# EAGLE schematic IceLogicBus (EAGLE 7.5.0)
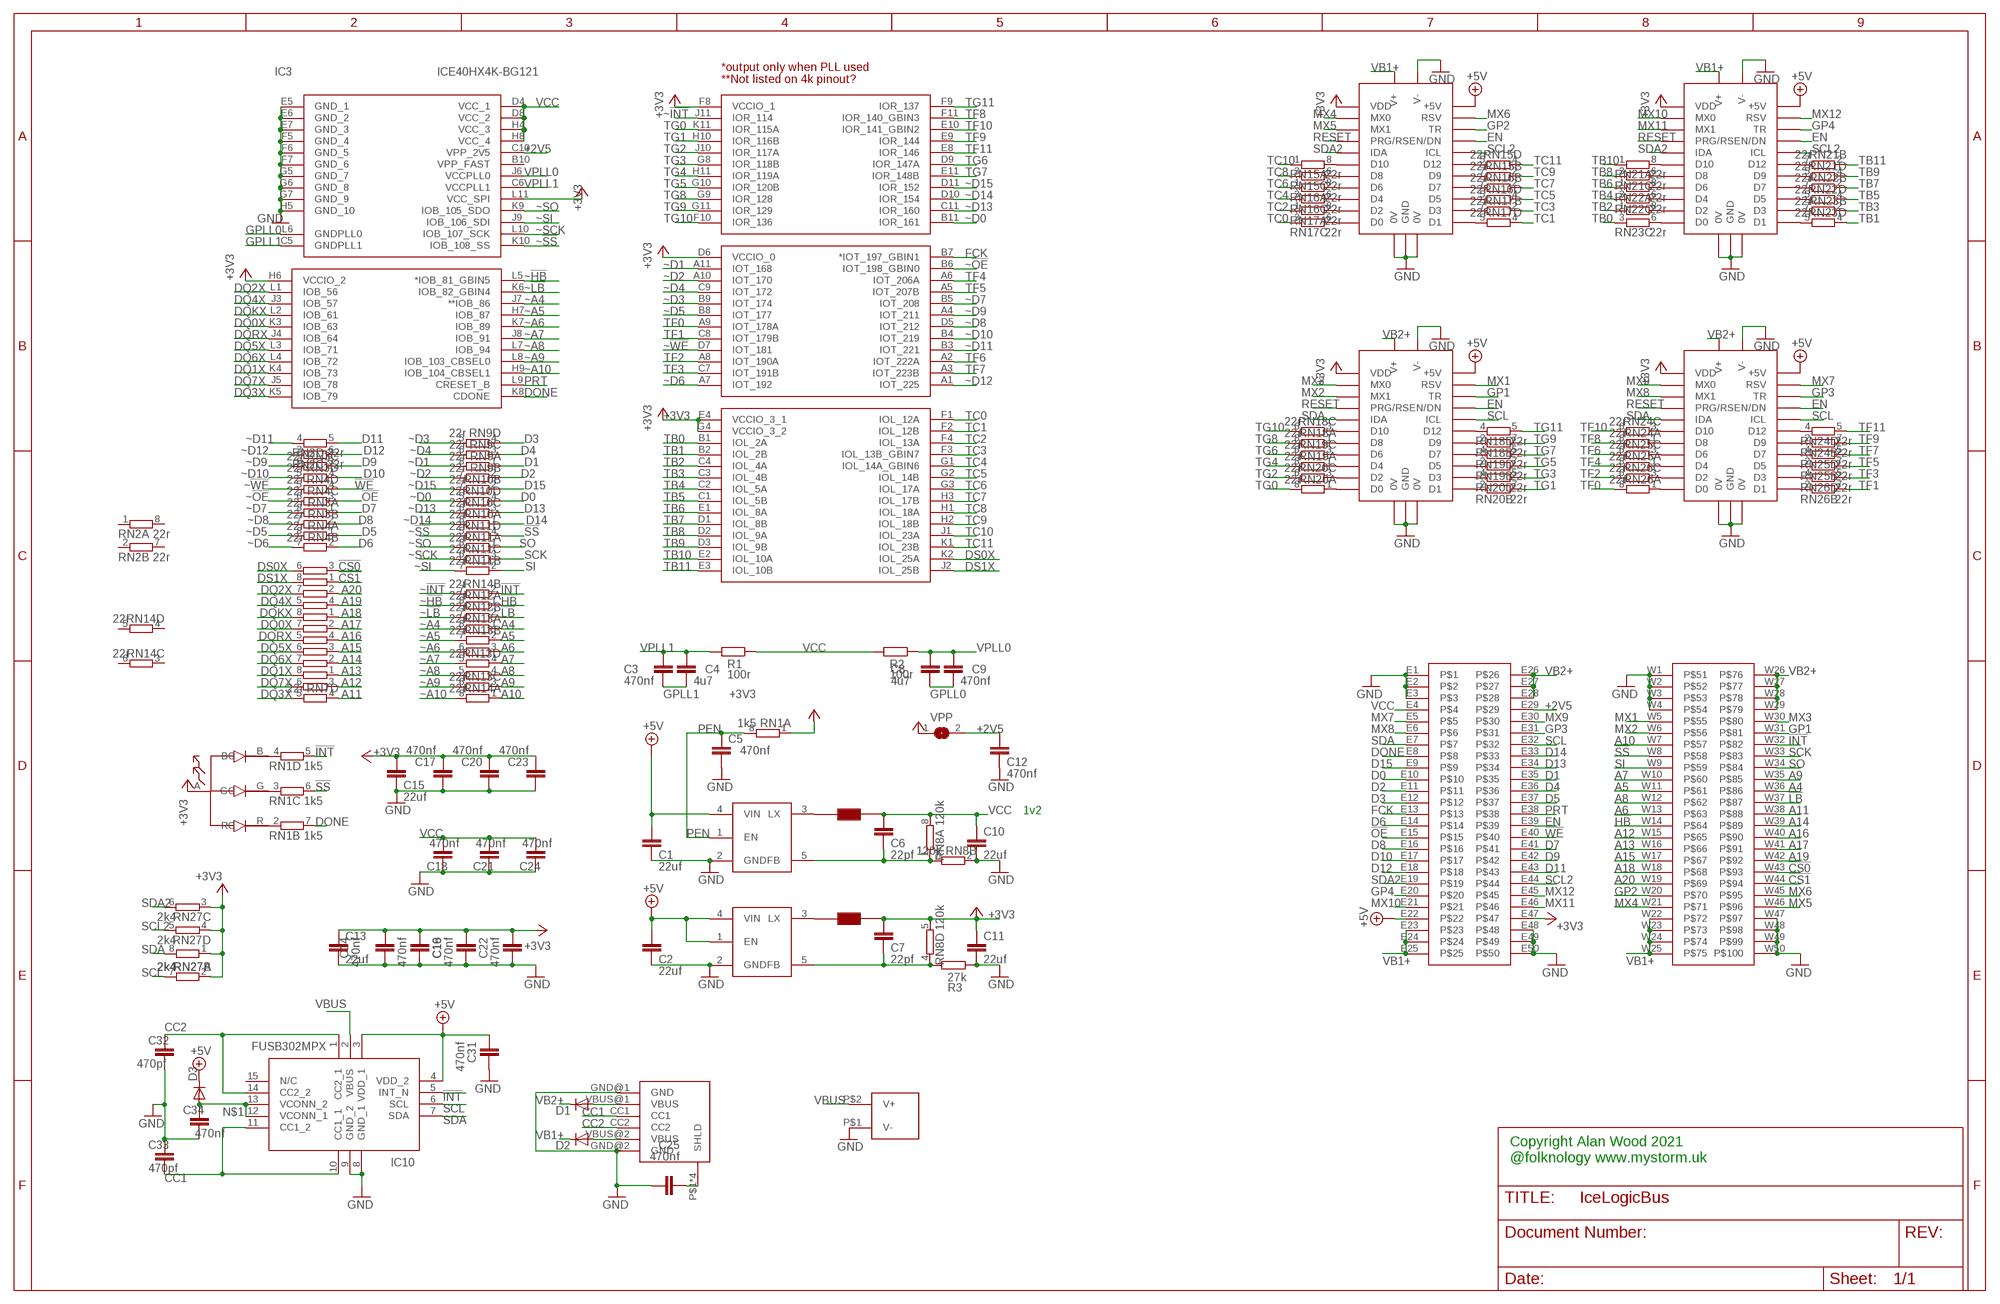
[diagram p0: schematic, sheet 1]

## Parts
C1  22uf  C-EUC0603  [C0603]
C2  22uf  C-EUC0603  [C0603]
C3  470nf  C-EUC0402  [C0402]
C4  4u7  C-EUC0402  [C0402]
C5  470nf  C-EUC0402  [C0402]
C6  22pf  C-EUC0402  [C0402]
C7  22pf  C-EUC0402  [C0402]
C8  4u7  C-EUC0402  [C0402]
C9  470nf  C-EUC0402  [C0402]
C10  22uf  C-EUC0603  [C0603]
C11  22uf  C-EUC0603  [C0603]
C12  470nf  C-EUC0402  [C0402]
C13  22uf  C-EUC0603  [C0603]
C14  470nf  C-EUC0402  [C0402]
C15  22uf  C-EUC0603  [C0603]
C16  470nf  C-EUC0402  [C0402]
C17  470nf  C-EUC0402  [C0402]
C18  470nf  C-EUC0402  [C0402]
C19  470nf  C-EUC0402  [C0402]
C20  470nf  C-EUC0402  [C0402]
C21  470nf  C-EUC0402  [C0402]
C22  470nf  C-EUC0402  [C0402]
C23  470nf  C-EUC0402  [C0402]
C24  470nf  C-EUC0402  [C0402]
C25  470nf  C-EUC0402  [C0402]
C31  470nf  C-EUC0402  [C0402]
C32  470pf  C-EUC0402  [C0402]
C33  470pf  C-EUC0402  [C0402]
C34  470nf  C-EUC0402  [C0402]
D1  DIODE-SOD123  [SOD123]
D2  DIODE-SOD123  [SOD123]
D3  DIODE-SOD323-W  [SOD323-W]
IC1  AP3429/A  [TSOP-5/SOT23-5]
IC2  AP3429/A  [TSOP-5/SOT23-5]
IC3  ICE40HX4K-BG121  [BGA121C80P11X11_900X900X110]
IC10  FUSB302MPX  [QFN50P250X250X80-15N]
L1  NRS4018  [NRC4018]
L2  NRS4018  [NRC4018]
L3  RGB_LED  [RGB_LED_IMM]
R1  100r  R-EU_R0402  [R0402]
R2  100r  R-EU_R0402  [R0402]
R3  27k  R-EU_R0402  [R0402]
RN1  1k5  4R-NEXB38V  [EXB38V]
RN2  22r  4R-NEXB38V  [EXB38V]
RN3  22r  4R-NEXB38V  [EXB38V]
RN4  22r  4R-NEXB38V  [EXB38V]
RN5  22r  4R-NEXB38V  [EXB38V]
RN6  22r  4R-NEXB38V  [EXB38V]
RN7  22r  4R-NEXB38V  [EXB38V]
RN8  120k  4R-NEXB38V  [EXB38V]
RN9  22r  4R-NEXB38V  [EXB38V]
RN10  22r  4R-NEXB38V  [EXB38V]
RN11  22r  4R-NEXB38V  [EXB38V]
RN12  22r  4R-NEXB38V  [EXB38V]
RN13  22r  4R-NEXB38V  [EXB38V]
RN14  22r  4R-NEXB38V  [EXB38V]
RN15  22r  4R-NEXB38V  [EXB38V]
RN16  22r  4R-NEXB38V  [EXB38V]
RN17  22r  4R-NEXB38V  [EXB38V]
RN18  22r  4R-NEXB38V  [EXB38V]
RN19  22r  4R-NEXB38V  [EXB38V]
RN20  22r  4R-NEXB38V  [EXB38V]
RN21  22r  4R-NEXB38V  [EXB38V]
RN22  22r  4R-NEXB38V  [EXB38V]
RN23  22r  4R-NEXB38V  [EXB38V]
RN24  22r  4R-NEXB38V  [EXB38V]
RN25  22r  4R-NEXB38V  [EXB38V]
RN26  22r  4R-NEXB38V  [EXB38V]
RN27  2k4  4R-NEXB38V  [EXB38V]
T1  UTILE_LPCARRIER_SMD_MALE_1.27  [UTILE_LP]
T2  UTILE_LPCARRIER_SMD_MALE_1.27  [UTILE_LP]
T3  MEZZANINE  [MEZZANINE]
T4  UTILE_LPCARRIER_SMD_MALE_1.27  [UTILE_LP]
T5  UTILE_LPCARRIER_SMD_MALE_1.27  [UTILE_LP]
U$1  USB-C-6  [USB-C-6]
U$2  XT-XXXT  [XT30PW-M]
VPP  SJ  [SJ]

## Nets
!CS0: RN5.3 T3.W43
!CS1: RN5.1 T3.W44
!HB: RN12.1 T3.W14
!INT: IC10.5(INT_N) RN1.5 RN14.2 T3.W32
!LB: RN12.2 T3.W37
!OE: RN4.3 T3.E15
!SS: RN1.6 RN11.4 T3.W8
!WE: RN4.4 T3.E40
+2V5: C12.2 IC3.C10(VPP_2V5) T3.E29 VPP.2
+3V3: C7.2 C11.1 C13.1 C14.2 C15.2 C16.2 C17.1 C19.2 C20.1 C22.2 C23.1 IC3.D6(VCCIO_0) IC3.E4(VCCIO_3_1) IC3.F8(VCCIO_1) IC3.G4(VCCIO_3_2) IC3.H6(VCCIO_2) IC3.L11(VCC_SPI) L2.P$2 L3.A(ANODE) RN1.1 RN8.5 RN27.1 RN27.2 RN27.3 RN27.4 T1.P$18(VDD) T2.P$18(VDD) T3.E47 T4.P$18(VDD) T5.P$18(VDD) VPP.1
+5V: C1.2 C2.2 C31.2 D3.C IC1.4(VIN) IC2.1(EN) IC2.4(VIN) IC10.3(VDD_1) IC10.4(VDD_2) T1.P$43(+5V) T2.P$43(+5V) T3.E22 T4.P$43(+5V) T5.P$43(+5V)
A4: RN13.1 T3.W36
A5: RN13.2 T3.W11
A6: RN12.3 T3.W13
A7: RN13.4 T3.W10
A8: RN12.4 T3.W12
A9: RN13.3 T3.W35
A10: RN14.1 T3.W7
A11: RN7.4 T3.W38
A12: RN7.3 T3.W15
A13: RN7.1 T3.W16
A14: RN7.2 T3.W39
A15: RN6.3 T3.W17
A16: RN6.4 T3.W40
A17: RN6.2 T3.W41
A18: RN6.1 T3.W18
A19: RN5.4 T3.W42
A20: RN5.2 T3.W19
CC1: C33.1 IC10.10(CC1_1) IC10.11(CC1_2) U$1.CC1
CC2: C32.2 IC10.1(CC2_1) IC10.14(CC2_2) U$1.CC2
D0: RN10.4 T3.E10
D1: RN9.1 T3.E35
D2: RN9.2 T3.E11
D3: RN9.4 T3.E12
D4: RN9.3 T3.E36
D5: RN4.1 T3.E37
D6: RN4.2 T3.E14
D7: RN3.1 T3.E41
D8: RN3.2 T3.E16
D9: RN3.3 T3.E42
D10: RN3.4 T3.E17
D11: RN2.5 T3.E43
D12: RN2.6 T3.E18
D13: RN10.3 T3.E34
D14: RN10.1 T3.E33
D15: RN10.2 T3.E9
DONE: IC3.K8(CDONE) RN1.7 T3.E8
DQ0X: IC3.K3(IOB_63) RN6.7
DQ1X: IC3.K4(IOB_73) RN7.8
DQ2X: IC3.L1(IOB_56) RN5.7
DQ3X: IC3.K5(IOB_79) RN7.5
DQ4X: IC3.J3(IOB_57) RN5.5
DQ5X: IC3.L3(IOB_71) RN6.6
DQ6X: IC3.L4(IOB_72) RN7.7
DQ7X: IC3.J5(IOB_78) RN7.6
DQKX: IC3.L2(IOB_61) RN6.8
DQRX: IC3.J4(IOB_64) RN6.5
DS0X: IC3.K2(IOL_25A) RN5.6
DS1X: IC3.J2(IOL_25B) RN5.8
EN: T1.P$40(EN/DN) T2.P$40(EN/DN) T3.E39 T4.P$40(EN/DN) T5.P$40(EN/DN)
FCK: IC3.B7(*IOT_197_GBIN1) T3.E13
GND: C1.1 C2.1 C5.2 C10.2 C11.2 C12.1 C13.2 C14.1 C15.1 C16.1 C17.2 C18.1 C19.1 C20.2 C21.1 C22.1 C23.2 C24.1 C25.1 C31.1 C32.1 C33.2 C34.1 IC1.2(GND) IC2.2(GND) IC3.E5(GND_1) IC3.E6(GND_2) IC3.E7(GND_3) IC3.F5(GND_4) IC3.F6(GND_5) IC3.F7(GND_6) IC3.G5(GND_7) IC3.G6(GND_8) IC3.G7(GND_9) IC3.H5(GND_10) IC10.8(GND_1) IC10.9(GND_2) R3.2 RN8.2 T1.0V@1(0V) T1.0V@2(0V) T1.P$1(V-) T1.P$2(V-) T1.P$3(V-) T1.P$4(V-) T1.P$5(V-) T1.P$6(V-) T1.P$7(GND) T1.P$26(V-) T1.P$27(V-) T1.P$28(V-) T1.P$29(V-) T1.P$30(V-) T1.P$31(V-) T1.P$32(GND) T2.0V@1(0V) T2.0V@2(0V) T2.P$1(V-) T2.P$2(V-) T2.P$3(V-) T2.P$4(V-) T2.P$5(V-) T2.P$6(V-) T2.P$7(GND) T2.P$26(V-) T2.P$27(V-) T2.P$28(V-) T2.P$29(V-) T2.P$30(V-) T2.P$31(V-) T2.P$32(GND) T3.E1 T3.E2 T3.E3 T3.E48 T3.E49 T3.E50 T3.W1 T3.W2 T3.W3 T3.W4 T3.W47 T3.W48 T3.W49 T3.W50 T4.0V@1(0V) T4.0V@2(0V) T4.P$1(V-) T4.P$2(V-) T4.P$3(V-) T4.P$4(V-) T4.P$5(V-) T4.P$6(V-) T4.P$7(GND) T4.P$26(V-) T4.P$27(V-) T4.P$28(V-) T4.P$29(V-) T4.P$30(V-) T4.P$31(V-) T4.P$32(GND) T5.0V@1(0V) T5.0V@2(0V) T5.P$1(V-) T5.P$2(V-) T5.P$3(V-) T5.P$4(V-) T5.P$5(V-) T5.P$6(V-) T5.P$7(GND) T5.P$26(V-) T5.P$27(V-) T5.P$28(V-) T5.P$29(V-) T5.P$30(V-) T5.P$31(V-) T5.P$32(GND) U$1.GND@1(GND) U$1.GND@2(GND) U$2.P$1(V-)
GP1: T2.P$41(TR) T3.W31
GP2: T1.P$41(TR) T3.W20
GP3: T3.E31 T5.P$41(TR)
GP4: T3.E20 T4.P$41(TR)
GPLL0: C8.1 C9.1 IC3.L6(GNDPLL0)
GPLL1: C3.1 C4.1 IC3.C5(GNDPLL1)
MX1: T2.P$42(RSV) T3.W5
MX2: T2.P$16(MX1) T3.W6
MX3: T2.P$17(MX0) T3.W30
MX4: T1.P$17(MX0) T3.W21
MX5: T1.P$16(MX1) T3.W46
MX6: T1.P$42(RSV) T3.W45
MX7: T3.E5 T5.P$42(RSV)
MX8: T3.E6 T5.P$16(MX1)
MX9: T3.E30 T5.P$17(MX0)
MX10: T3.E21 T4.P$17(MX0)
MX11: T3.E46 T4.P$16(MX1)
MX12: T3.E45 T4.P$42(RSV)
N$1: C34.2 D3.A IC10.12(VCONN_1) IC10.13(VCONN_2)
N$2: L3.G(GC) RN1.3
N$3: C25.2 U$1.P$1(SHLD) U$1.P$2(SHLD) U$1.P$3(SHLD) U$1.P$4(SHLD)
N$4: L3.R(RC) RN1.2
N$6: L3.B(BC) RN1.4
N$8: RN23.6 T4.P$8(D0)
N$9: RN23.5 T4.P$33(D1)
N$15: RN23.8 T4.P$9(D2)
N$16: RN23.7 T4.P$34(D3)
N$17: RN22.6 T4.P$10(D4)
N$18: C7.1 IC2.5(FB) R3.1 RN8.4
N$19: IC2.3(LX) L2.P$1
N$20: RN22.5 T4.P$35(D5)
N$21: RN22.8 T4.P$11(D6)
N$22: RN22.7 T4.P$36(D7)
N$23: RN21.6 T4.P$12(D8)
N$24: RN21.5 T4.P$37(D9)
N$25: RN21.8 T4.P$13(D10)
N$26: RN21.7 T4.P$38(D12)
N$27: RN17.8 T1.P$9(D2)
N$28: RN17.6 T1.P$8(D0)
N$29: RN17.7 T1.P$34(D3)
N$30: RN17.5 T1.P$33(D1)
N$31: RN16.8 T1.P$11(D6)
N$32: RN16.6 T1.P$10(D4)
N$33: RN16.5 T1.P$35(D5)
N$34: RN16.7 T1.P$36(D7)
N$35: RN15.8 T1.P$13(D10)
N$36: RN15.6 T1.P$12(D8)
N$37: RN15.7 T1.P$37(D9)
N$38: RN15.5 T1.P$38(D12)
N$39: RN26.3 T5.P$9(D2)
N$40: RN26.1 T5.P$8(D0)
N$41: RN26.4 T5.P$34(D3)
N$42: RN26.2 T5.P$33(D1)
N$43: RN25.3 T5.P$11(D6)
N$44: RN25.1 T5.P$10(D4)
N$45: RN25.4 T5.P$36(D7)
N$46: RN25.2 T5.P$35(D5)
N$47: RN24.3 T5.P$13(D10)
N$48: RN24.1 T5.P$12(D8)
N$49: RN24.4 T5.P$38(D12)
N$50: RN24.2 T5.P$37(D9)
N$51: RN20.3 T2.P$9(D2)
N$52: RN20.1 T2.P$8(D0)
N$53: RN20.4 T2.P$34(D3)
N$54: RN20.2 T2.P$33(D1)
N$55: RN19.3 T2.P$11(D6)
N$56: RN19.1 T2.P$10(D4)
N$57: RN19.4 T2.P$36(D7)
N$58: RN19.2 T2.P$35(D5)
N$59: RN18.3 T2.P$13(D10)
N$60: RN18.1 T2.P$12(D8)
N$61: RN18.4 T2.P$38(D12)
N$62: RN18.2 T2.P$37(D9)
N$93: C6.1 IC1.5(FB) RN8.1 RN8.7
N$94: IC1.3(LX) L1.P$1
PEN: C5.1 IC1.1(EN) RN1.8
PRT: IC3.L9(CRESET_B) T3.E38
RESET: T1.P$15(PRG/RS) T2.P$15(PRG/RS) T4.P$15(PRG/RS) T5.P$15(PRG/RS)
SCK: RN11.3 T3.W33
SCL: IC10.6(SCL) RN27.7 T2.P$39(ICL) T3.E32 T5.P$39(ICL)
SCL2: RN27.5 T1.P$39(ICL) T3.E44 T4.P$39(ICL)
SDA: IC10.7(SDA) RN27.8 T2.P$14(IDA) T3.E7 T5.P$14(IDA)
SDA2: RN27.6 T1.P$14(IDA) T3.E19 T4.P$14(IDA)
SI: RN11.2 T3.W9
SO: RN11.1 T3.W34
TB0: IC3.B1(IOL_2A) RN23.3
TB1: IC3.B2(IOL_2B) RN23.4
TB2: IC3.C4(IOL_4A) RN23.1
TB3: IC3.C3(IOL_4B) RN23.2
TB4: IC3.C2(IOL_5A) RN22.3
TB5: IC3.C1(IOL_5B) RN22.4
TB6: IC3.E1(IOL_8A) RN22.1
TB7: IC3.D1(IOL_8B) RN22.2
TB8: IC3.D2(IOL_9A) RN21.3
TB9: IC3.D3(IOL_9B) RN21.4
TB10: IC3.E2(IOL_10A) RN21.1
TB11: IC3.E3(IOL_10B) RN21.2
TC0: IC3.F1(IOL_12A) RN17.3
TC1: IC3.F2(IOL_12B) RN17.4
TC2: IC3.F4(IOL_13A) RN17.1
TC3: IC3.F3(IOL_13B_GBIN7) RN17.2
TC4: IC3.G1(IOL_14A_GBIN6) RN16.3
TC5: IC3.G2(IOL_14B) RN16.4
TC6: IC3.G3(IOL_17A) RN16.1
TC7: IC3.H3(IOL_17B) RN16.2
TC8: IC3.H1(IOL_18A) RN15.3
TC9: IC3.H2(IOL_18B) RN15.2
TC10: IC3.J1(IOL_23A) RN15.1
TC11: IC3.K1(IOL_23B) RN15.4
TF0: IC3.A9(IOT_178A) RN26.8
TF1: IC3.C8(IOT_179B) RN26.7
TF2: IC3.A8(IOT_190A) RN26.6
TF3: IC3.C7(IOT_191B) RN26.5
TF4: IC3.A6(IOT_206A) RN25.8
TF5: IC3.A5(IOT_207B) RN25.7
TF6: IC3.A2(IOT_222A) RN25.6
TF7: IC3.A3(IOT_223B) RN25.5
TF8: IC3.F11(IOR_140_GBIN3) RN24.8
TF9: IC3.E9(IOR_144) RN24.7
TF10: IC3.E10(IOR_141_GBIN2) RN24.6
TF11: IC3.E8(IOR_146) RN24.5
TG0: IC3.K11(IOR_115A) RN20.8
TG1: IC3.H10(IOR_116B) RN20.7
TG2: IC3.J10(IOR_117A) RN20.6
TG3: IC3.G8(IOR_118B) RN20.5
TG4: IC3.H11(IOR_119A) RN19.8
TG5: IC3.G10(IOR_120B) RN19.7
TG6: IC3.D9(IOR_147A) RN19.6
TG7: IC3.E11(IOR_148B) RN19.5
TG8: IC3.G9(IOR_128) RN18.8
TG9: IC3.G11(IOR_129) RN18.7
TG10: IC3.F10(IOR_136) RN18.6
TG11: IC3.F9(IOR_137) RN18.5
VB1+: D2.C T1.P$20(V+) T1.P$21(V+) T1.P$22(V+) T1.P$23(V+) T1.P$24(V+) T1.P$25(V+) T1.P$45(V+) T1.P$46(V+) T1.P$47(V+) T1.P$48(V+) T1.P$49(V+) T1.P$50(V+) T3.E23 T3.E24 T3.E25 T3.W22 T3.W23 T3.W24 T3.W25 T4.P$20(V+) T4.P$21(V+) T4.P$22(V+) T4.P$23(V+) T4.P$24(V+) T4.P$25(V+) T4.P$45(V+) T4.P$46(V+) T4.P$47(V+) T4.P$48(V+) T4.P$49(V+) T4.P$50(V+)
VB2+: D1.C T2.P$20(V+) T2.P$21(V+) T2.P$22(V+) T2.P$23(V+) T2.P$24(V+) T2.P$25(V+) T2.P$45(V+) T2.P$46(V+) T2.P$47(V+) T2.P$48(V+) T2.P$49(V+) T2.P$50(V+) T3.E26 T3.E27 T3.E28 T3.W26 T3.W27 T3.W28 T3.W29 T5.P$20(V+) T5.P$21(V+) T5.P$22(V+) T5.P$23(V+) T5.P$24(V+) T5.P$25(V+) T5.P$45(V+) T5.P$46(V+) T5.P$47(V+) T5.P$48(V+) T5.P$49(V+) T5.P$50(V+)
VBUS: D1.A D2.A IC10.2(VBUS) U$1.VBUS@1(VBUS) U$1.VBUS@2(VBUS) U$2.P$2(V+)
VCC: C6.2 C10.1 C18.2 C21.2 C24.2 IC3.D4(VCC_1) IC3.D8(VCC_2) IC3.H4(VCC_3) IC3.H8(VCC_4) L1.P$2 R1.1 R2.2 RN8.8 T3.E4
VPLL0: C8.2 C9.2 IC3.J6(VCCPLL0) R2.1
VPLL1: C3.2 C4.2 IC3.C6(VCCPLL1) R1.2
~!HB: IC3.L5(*IOB_81_GBIN5) RN12.8
~!INT: IC3.J11(IOR_114) RN14.7
~!LB: IC3.K6(IOB_82_GBIN4) RN12.7
~!OE: IC3.B6(IOT_198_GBIN0) RN4.6
~!SS: IC3.K10(IOB_108_SS) RN11.5
~!WE: IC3.D7(IOT_181) RN4.5
~A4: IC3.J7(**IOB_86) RN13.8
~A5: IC3.H7(IOB_87) RN13.7
~A6: IC3.K7(IOB_89) RN12.6
~A7: IC3.J8(IOB_91) RN13.5
~A8: IC3.L7(IOB_94) RN12.5
~A9: IC3.L8(IOB_103_CBSEL0) RN13.6
~A10: IC3.H9(IOB_104_CBSEL1) RN14.8
~D0: IC3.B11(IOR_161) RN10.5
~D1: IC3.A11(IOT_168) RN9.8
~D2: IC3.A10(IOT_170) RN9.7
~D3: IC3.B9(IOT_174) RN9.5
~D4: IC3.C9(IOT_172) RN9.6
~D5: IC3.B8(IOT_177) RN4.8
~D6: IC3.A7(IOT_192) RN4.7
~D7: IC3.B5(IOT_208) RN3.8
~D8: IC3.D5(IOT_212) RN3.7
~D9: IC3.A4(IOT_211) RN3.6
~D10: IC3.B4(IOT_219) RN3.5
~D11: IC3.B3(IOT_221) RN2.4
~D12: IC3.A1(IOT_225) RN2.3
~D13: IC3.C11(IOR_160) RN10.6
~D14: IC3.D10(IOR_154) RN10.8
~D15: IC3.D11(IOR_152) RN10.7
~SCK: IC3.L10(IOB_107_SCK) RN11.6
~SI: IC3.J9(IOB_106_SDI) RN11.7
~SO: IC3.K9(IOB_105_SDO) RN11.8
Unconnected: IC3.B10(VPP_FAST) IC10.15(N/C) RN2.1 RN2.2 RN2.7 RN2.8 RN8.3 RN8.6 RN14.3 RN14.4 RN14.5 RN14.6 U$2.P$3 U$2.P$4

## Notes on the sheet
- 1v2
- Copyright Alan Wood 2021
  @folknology www.mystorm.uk

## Library data of the parts
C1-C25 C31-C34 = rcl:C-EU: CAPACITOR, European symbol
D1-D3 = diode:DIODE-: DIODE
IC1 IC2 = amino:AP3429/A
IC3 = SamacSys_Parts:ICE40HX4K-BG121: IC FPGA 93 I/O 121CABGA Source: Datasheet <http://www.latticesemi.com/iCE40>; DESCRIPTION: IC FPGA 93 I/O 121CABGA; HEIGHT: 1.1mm; MANUFACTURER_NAME: Lattice Semiconductor; MANUFACTURER_PART_NUMBER: ICE40HX4K-BG121; MOUSER_PART_NUMBER: 842-ICE40HX4K-BG121; MOUSER_PRICE-STOCK: https://www.mouser.co.uk/ProductDetail/Lattice/ICE40HX4K-BG121?qs=r5DSvlrkXmJ1BLZOg5%2FxBQ%3D%3D
IC10 = SamacSys_Parts:FUSB302MPX: USB-C Controller w/PD 2.0 WQFN-14 Source: Datasheet <http://www.onsemi.com/pub/Collateral/FUSB302-D.PDF>; DESCRIPTION: USB-C Controller w/PD 2.0 WQFN-14; HEIGHT: 0.8mm; MANUFACTURER_NAME: ON Semiconductor; MANUFACTURER_PART_NUMBER: FUSB302MPX; MOUSER_PART_NUMBER: 512-FUSB302MPX; MOUSER_PRICE-STOCK: https://www.mouser.co.uk/ProductDetail/ON-Semiconductor-Fairchild/FUSB302MPX?qs=4SZXFaw57sm8ZmQ7q6qVtQ%3D%3D
L1 L2 = amino:NRS4018
L3 = amino:RGB_LED
R1-R3 = resistor:R-EU_: RESISTOR, European symbol
RN1-RN27 = resistor-dil:4R-N: Array Chip Resistor Source: RS Component / Phycomp; OC_FARNELL: unknown; OC_NEWARK: unknown
T1 T2 T4 T5 = amino:UTILE_LP
T3 = amino:MEZZANINE
U$1 = amino:USB-C-6
U$2 = amino:XT-XX
VPP = jumper:SJ: SMD solder JUMPER